# Altium schematic sheet 22 PCIE.SchDoc
size 420 x 297 mm; Address1: Address1; Address2: Address2; Address3: Address3; Address4: Address4; DocumentNumber: АБВГ.123456.001 Э3; SheetNumber: 22; SheetTotal: 23; Scale: 1:1; DocumentType: Схема электрическая принципиальная; FirstReferrence: АБВГ.123456.001
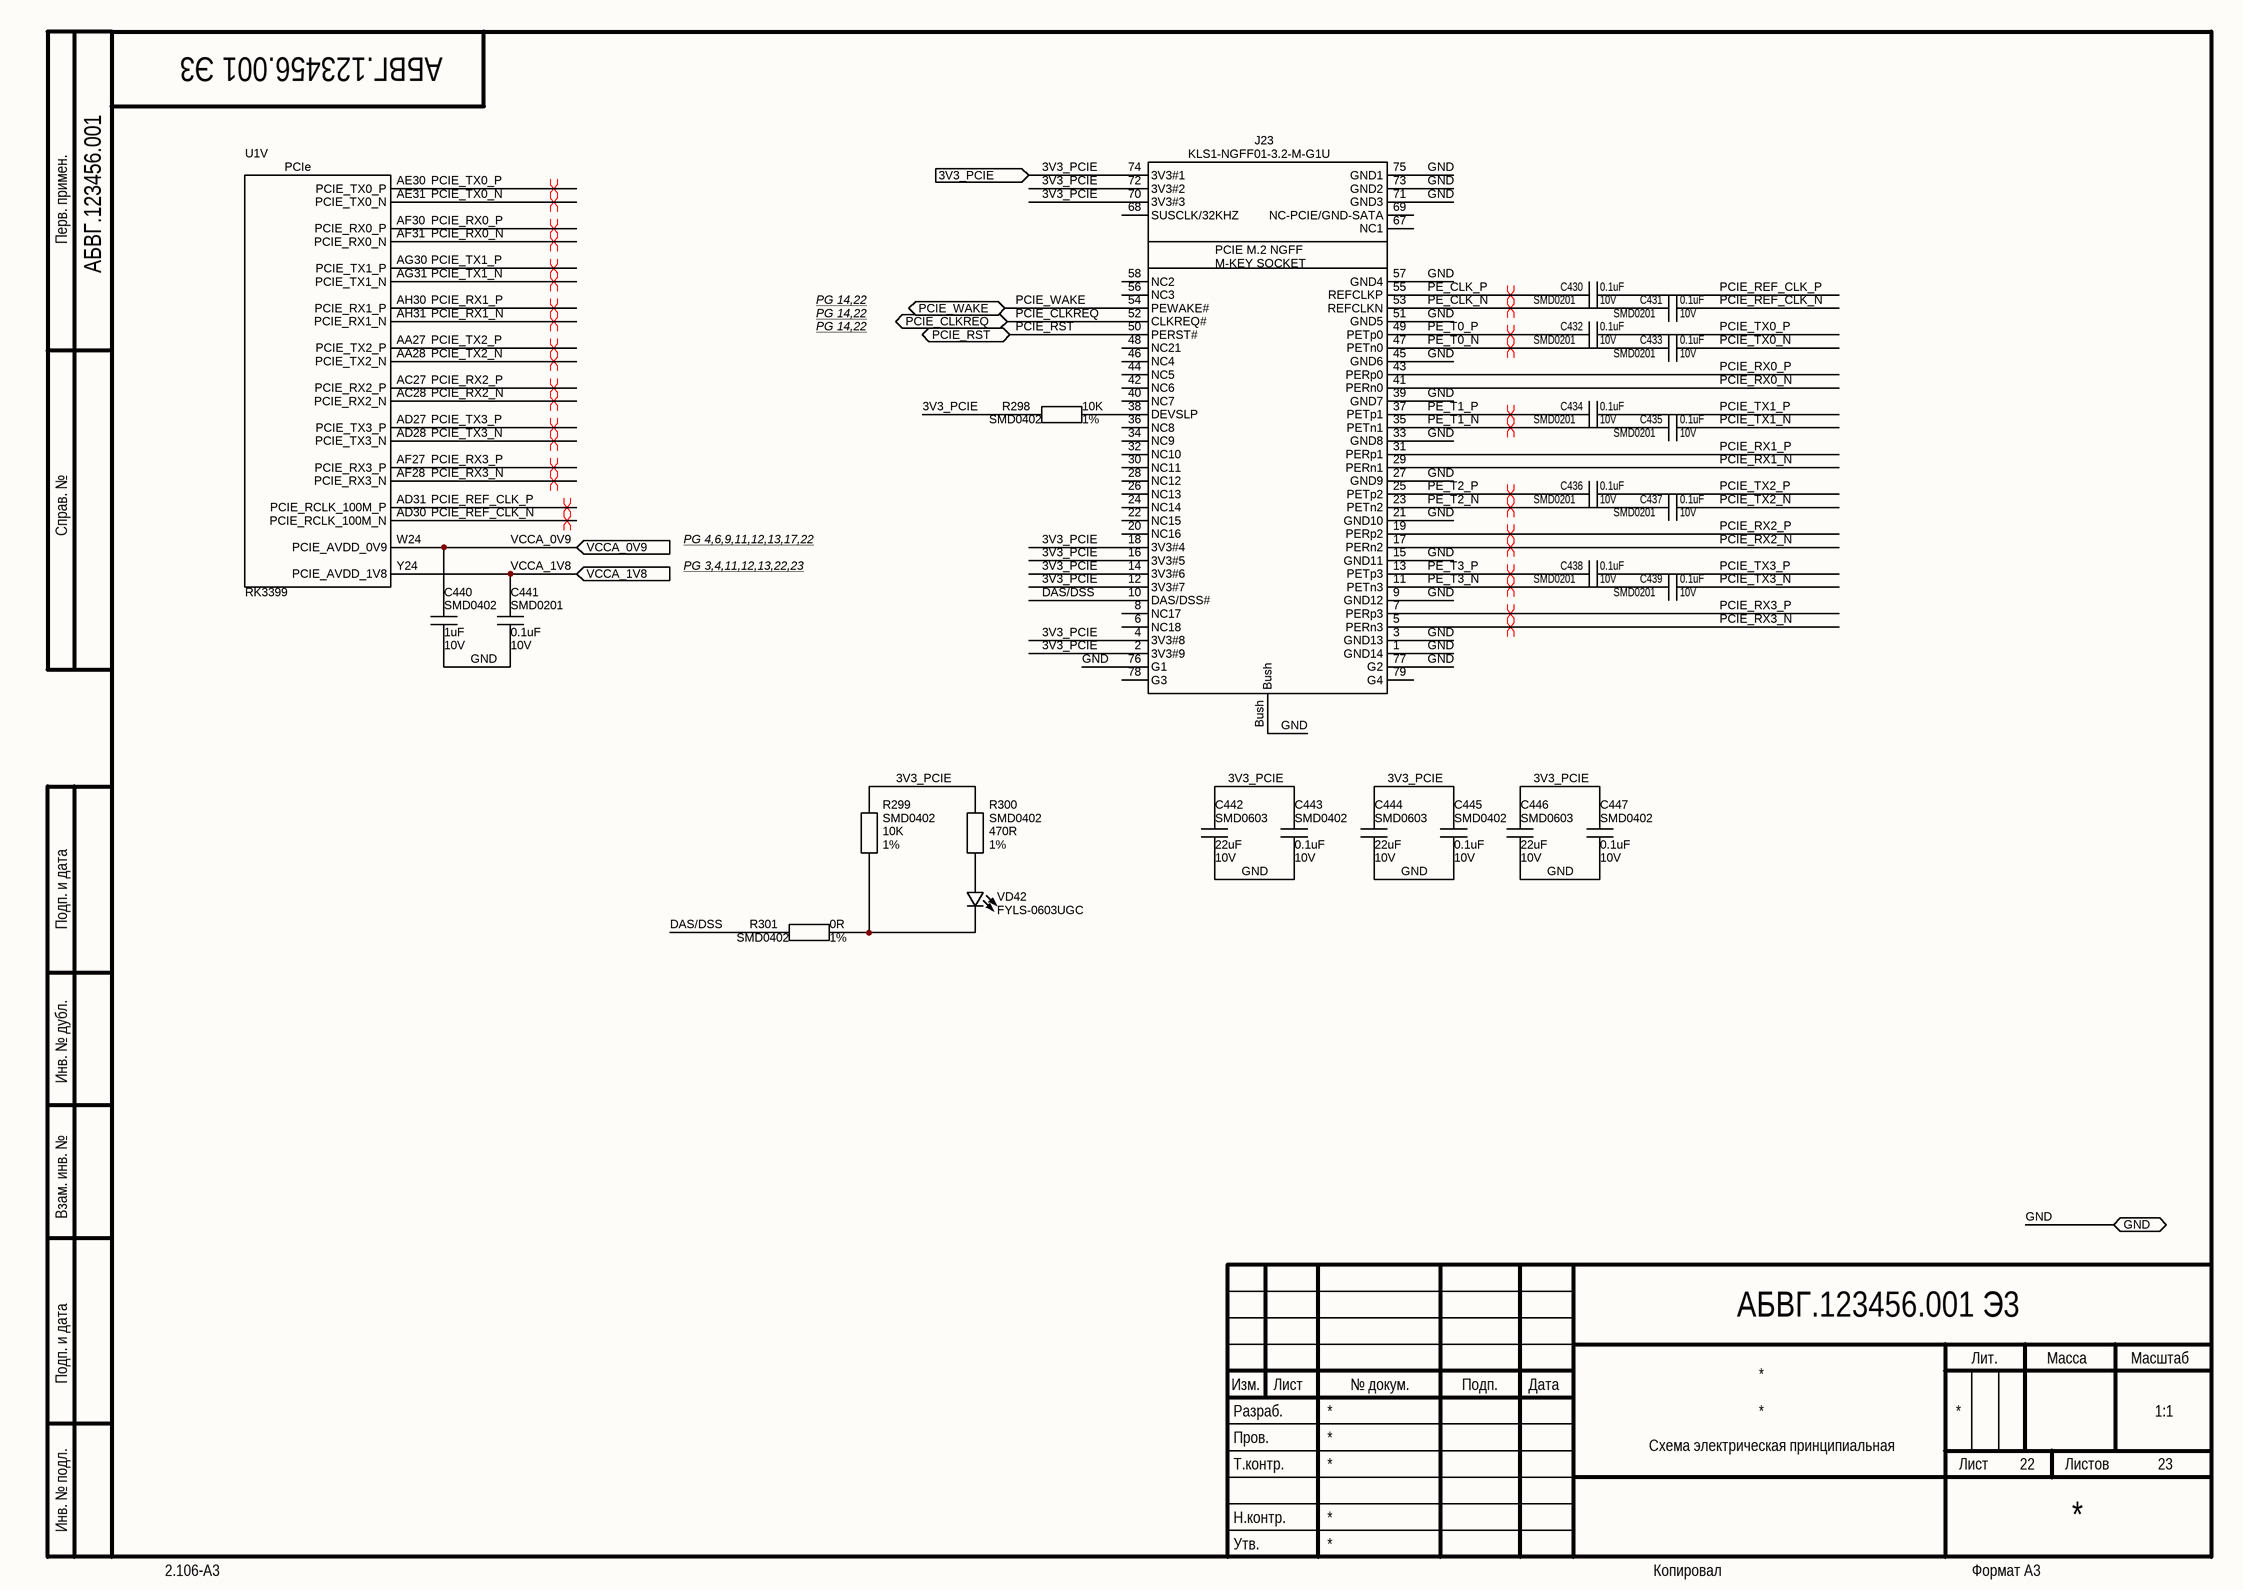
[diagram p0: 22 PCIE.SchDoc]

## Parts
C430  Package: SMD0201  Voltage: 10V  [CAP_SMD_0201]  (hidden comment: 0.1uF)
C431  Package: SMD0201  Voltage: 10V  [CAP_SMD_0201]  (hidden comment: 0.1uF)
C432  Package: SMD0201  Voltage: 10V  [CAP_SMD_0201]  (hidden comment: 0.1uF)
C433  Package: SMD0201  Voltage: 10V  [CAP_SMD_0201]  (hidden comment: 0.1uF)
C434  Package: SMD0201  Voltage: 10V  [CAP_SMD_0201]  (hidden comment: 0.1uF)
C435  Package: SMD0201  Voltage: 10V  [CAP_SMD_0201]  (hidden comment: 0.1uF)
C436  Package: SMD0201  Voltage: 10V  [CAP_SMD_0201]  (hidden comment: 0.1uF)
C437  Package: SMD0201  Voltage: 10V  [CAP_SMD_0201]  (hidden comment: 0.1uF)
C438  Package: SMD0201  Voltage: 10V  [CAP_SMD_0201]  (hidden comment: 0.1uF)
C439  Package: SMD0201  Voltage: 10V  [CAP_SMD_0201]  (hidden comment: 0.1uF)
C440  Package: SMD0402  Voltage: 10V  [CAP_SMD_0402_small]  (hidden comment: 1uF)
C441  Package: SMD0201  Voltage: 10V  [CAP_SMD_0201]  (hidden comment: 0.1uF)
C442  Package: SMD0603  Voltage: 10V  [CAP_SMD_0603]  (hidden comment: 22uF)
C443  Package: SMD0402  Voltage: 10V  [CAP_SMD_0402]  (hidden comment: 0.1uF)
C444  Package: SMD0603  Voltage: 10V  [CAP_SMD_0603]  (hidden comment: 22uF)
C445  Package: SMD0402  Voltage: 10V  [CAP_SMD_0402]  (hidden comment: 0.1uF)
C446  Package: SMD0603  Voltage: 10V  [CAP_SMD_0603]  (hidden comment: 22uF)
C447  Package: SMD0402  Voltage: 10V  [CAP_SMD_0402]  (hidden comment: 0.1uF)
J23  KLS1-NGFF01-3.2-M-G1U  [KLS1-NGFF01-3.2-M-G1U_42mm]
R298  Package: SMD0402  Tolerance: 1%  [RES_SMD_0402]  (hidden comment: 10K)
R299  Package: SMD0402  Tolerance: 1%  [RES_SMD_0402]  (hidden comment: 10K)
R300  Package: SMD0402  Tolerance: 1%  [RES_SMD_0402]  (hidden comment: 470R)
R301  Package: SMD0402  Tolerance: 1%  [RES_SMD_0402]  (hidden comment: 0R)
U1  value RK3399  [BGA828C65P31X31_2100X2100X161N]  (hidden comment: RK3399_FF)  (part V of 23)
VD42  FYLS-0603UGC  [LED_0603]

## Ports
3V3_PCIE (in), GND (bidir), PCIE_CLKREQ (bidir), PCIE_RST (bidir), PCIE_WAKE (bidir), VCCA_0V9 (in), VCCA_1V8 (in)

## Nets
3V3_PCIE: C442.2 C443.1 C444.2 C445.1 C446.2 C447.1 J23.2(3V3#9) J23.4(3V3#8) J23.12(3V3#7) J23.14(3V3#6) J23.16(3V3#5) J23.18(3V3#4) J23.70(3V3#3) J23.72(3V3#2) J23.74(3V3#1) R298.2 R299.2 R300.2 ; port 3V3_PCIE
DAS/DSS: J23.10(DAS/DSS#) R301.2
GND: C440.2 C441.2 C442.1 C443.2 C444.1 C445.2 C446.1 C447.2 J23.1(GND14) J23.3(GND13) J23.9(GND12) J23.15(GND11) J23.21(GND10) J23.27(GND9) J23.33(GND8) J23.39(GND7) J23.45(GND6) J23.51(GND5) J23.57(GND4) J23.71(GND3) J23.73(GND2) J23.75(GND1) J23.76(G1) J23.77(G2) J23.Bush ; port GND
PCIE_CLKREQ: J23.52(CLKREQ#) ; port PCIE_CLKREQ
PCIE_REF_CLK_N: C431.1 U1.AD30(PCIE_RCLK_100M_N)
PCIE_REF_CLK_P: C430.1 U1.AD31(PCIE_RCLK_100M_P)
PCIE_RST: J23.50(PERST#) ; port PCIE_RST
PCIE_RX0_N: J23.41(PERn0) U1.AF31(PCIE_RX0_N)
PCIE_RX0_P: J23.43(PERp0) U1.AF30(PCIE_RX0_P)
PCIE_RX1_N: J23.29(PERn1) U1.AH31(PCIE_RX1_N)
PCIE_RX1_P: J23.31(PERp1) U1.AH30(PCIE_RX1_P)
PCIE_RX2_N: J23.17(PERn2) U1.AC28(PCIE_RX2_N)
PCIE_RX2_P: J23.19(PERp2) U1.AC27(PCIE_RX2_P)
PCIE_RX3_N: J23.5(PERn3) U1.AF28(PCIE_RX3_N)
PCIE_RX3_P: J23.7(PERp3) U1.AF27(PCIE_RX3_P)
PCIE_TX0_N: C433.1 U1.AE31(PCIE_TX0_N)
PCIE_TX0_P: C432.1 U1.AE30(PCIE_TX0_P)
PCIE_TX1_N: C435.1 U1.AG31(PCIE_TX1_N)
PCIE_TX1_P: C434.1 U1.AG30(PCIE_TX1_P)
PCIE_TX2_N: C437.1 U1.AA28(PCIE_TX2_N)
PCIE_TX2_P: C436.1 U1.AA27(PCIE_TX2_P)
PCIE_TX3_N: C439.1 U1.AD28(PCIE_TX3_N)
PCIE_TX3_P: C438.1 U1.AD27(PCIE_TX3_P)
PCIE_WAKE: J23.54(PEWAKE#) ; port PCIE_WAKE
PE_CLK_N: C431.2 J23.53(REFCLKN)
PE_CLK_P: C430.2 J23.55(REFCLKP)
PE_T0_N: C433.2 J23.47(PETn0)
PE_T0_P: C432.2 J23.49(PETp0)
PE_T1_N: C435.2 J23.35(PETn1)
PE_T1_P: C434.2 J23.37(PETp1)
PE_T2_N: C437.2 J23.23(PETn2)
PE_T2_P: C436.2 J23.25(PETp2)
PE_T3_N: C439.2 J23.11(PETn3)
PE_T3_P: C438.2 J23.13(PETp3)
VCCA_0V9: C440.1 U1.W24(PCIE_AVDD_0V9) ; port VCCA_0V9
VCCA_1V8: C441.1 U1.Y24(PCIE_AVDD_1V8) ; port VCCA_1V8
NetJ23_38: J23.38(DEVSLP) R298.1
NetR299_1: R299.1 R301.1 VD42.2(C)
NetR300_1: R300.1 VD42.1(A)

Not connected (* = marked no-connect by the designer): J23 6(NC18) 8(NC17) 20(NC16) 22(NC15) 24(NC14) 26(NC13) 28(NC12) 30(NC11) 32(NC10) 34(NC9) 36(NC8) 40(NC7) 42(NC6) 44(NC5) 46(NC4) 48(NC21) 56(NC3) 58(NC2) 67(NC1) 68(SUSCLK/32KHZ) 69(NC-PCIE/GND-SATA) 78(G3) 79(G4)

## Layout directives
differential pair; differential pair class DiffPair_1; net class DiffPair_1: PCIE_REF_CLK_N, PCIE_REF_CLK_P, PCIE_RX0_N, PCIE_RX0_P, PCIE_RX1_N, PCIE_RX1_P, PCIE_RX2_N, PCIE_RX2_P, PCIE_RX3_N, PCIE_RX3_P, PCIE_TX0_N, PCIE_TX0_P, PCIE_TX1_N, PCIE_TX1_P, PCIE_TX2_N, PCIE_TX2_P, PCIE_TX3_N, PCIE_TX3_P, PE_CLK_N, PE_CLK_P, PE_T0_N, PE_T0_P, PE_T1_N, PE_T1_P, PE_T2_N, PE_T2_P, PE_T3_N, PE_T3_P

## Notes on the sheet
- Перв. примен.
- PG 14,22
- Справ. №
- PG 3,4,11,12,13,22,23
- PG 4,6,9,11,12,13,17,22
- Подп. и дата
- Инв. № дубл.
- Взам. инв. №
- Разраб.
- Изм.
- Лист
- № докум.
- Подп.
- Дата
- Лит.
- Масса
- Масштаб
- Пров.
- Т.контр.
- Листов
- Инв. № подл.
- Утв.
- Н.контр.
- 2.106-A3
- Копировал
- Формат А3
- (in symbol KLS1-NGFF01-3.2-M-G1U_1) PCIE M.2 NGFF / M-KEY SOCKET
- (in symbol RK3399_FF, part V) PCIe

## Library data of the parts
C430-C439 C441 = Ceramic_Cap: PartNumber: CC0201KRX5R6BB104; ComponentType: SMD Ceramic Chip Capacitor; Manufacter: *; Tolerance: *; ClassName: *; Value: 0.1uF
C440 = Ceramic_Cap: PartNumber: CC0402KRX5R6BB105; ComponentType: SMD Ceramic Chip Capacitor; Manufacter: *; Tolerance: *; ClassName: Solder_Clearence; Value: 1uF
C442 C444 C446 = Ceramic_Cap: PartNumber: CL10A226MP8NUNE; ComponentType: SMD Ceramic Chip Capacitor; Manufacter: *; Tolerance: *; ClassName: *; Value: 22uF
C443 C445 C447 = Ceramic_Cap: PartNumber: CC0402KRX5R6BB104; ComponentType: SMD Ceramic Chip Capacitor; Manufacter: *; Tolerance: *; ClassName: *; Value: 0.1uF
J23 = KLS1-NGFF01-3.2-M-G1U_1: ComponentType: SMD Chip Resistor; Manufacter: *; Voltage: *; ClassName: *; Tolerance: *; PartNumber: KLS1-NGFF01-3.2-M-G1U; Package: KLS1-NGFF01-3.2-M-G1U; Value: KLS1-NGFF01-3.2-M-G1U
R298 R299 = Chip_Res: PartNumber: RC0402FR-0710KL; ComponentType: SMD Chip Resistor; Manufacter: *; Voltage: *; ClassName: *; Value: 10K
R300 = Chip_Res: PartNumber: RC0402FR-07470RL; ComponentType: SMD Chip Resistor; Manufacter: *; Voltage: *; ClassName: *; Value: 470R
R301 = Chip_Res: PartNumber: RC0402FR-070RL; ComponentType: SMD Chip Resistor; Manufacter: *; Voltage: *; ClassName: *; Value: 0R
VD42 = LED: ComponentType: *; Manufacter: *; Package: SMD0603; PartNumber: FYLS-0603UGC; Value: FYLS-0603UGC
U1 = RK3399_FF: Package: BGA828; ComponentType: *; Manufacter: *; PartNumber: RK3399; ClassName: *